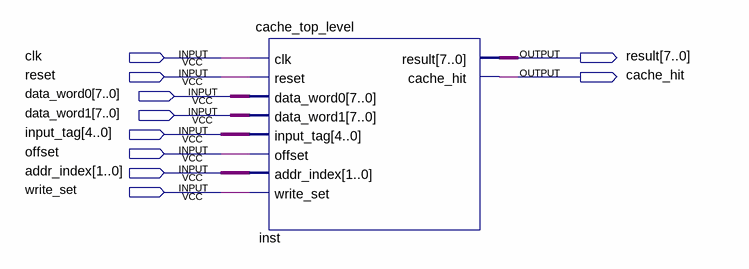
[diagram p0: schematic sheet]
// Quartus schematic laba8_var12_v1.bdf as structural Verilog: 1 symbols, 10 pins
module laba8_var12_v1 (
  input  clk,
  input  reset,
  input  [7:0] data_word0,
  input  [7:0] data_word1,
  input  [4:0] input_tag,
  input  offset,
  input  [1:0] addr_index,
  input  write_set,
  output [7:0] result,
  output cache_hit
);

  cache_top_level inst (
    .clk(clk), .reset(reset), .data_word0(data_word0), .data_word1(data_word1), .input_tag(input_tag),
    .offset(offset), .addr_index(addr_index), .write_set(write_set), .result(result), .cache_hit(cache_hit));
endmodule
